# EAGLE design EBN_DUAL_V01 (EAGLE 7.3.0)
CNAME: EasyBoard Nano; CREVISION: 0.1; DESIGNER: Martin Olejar
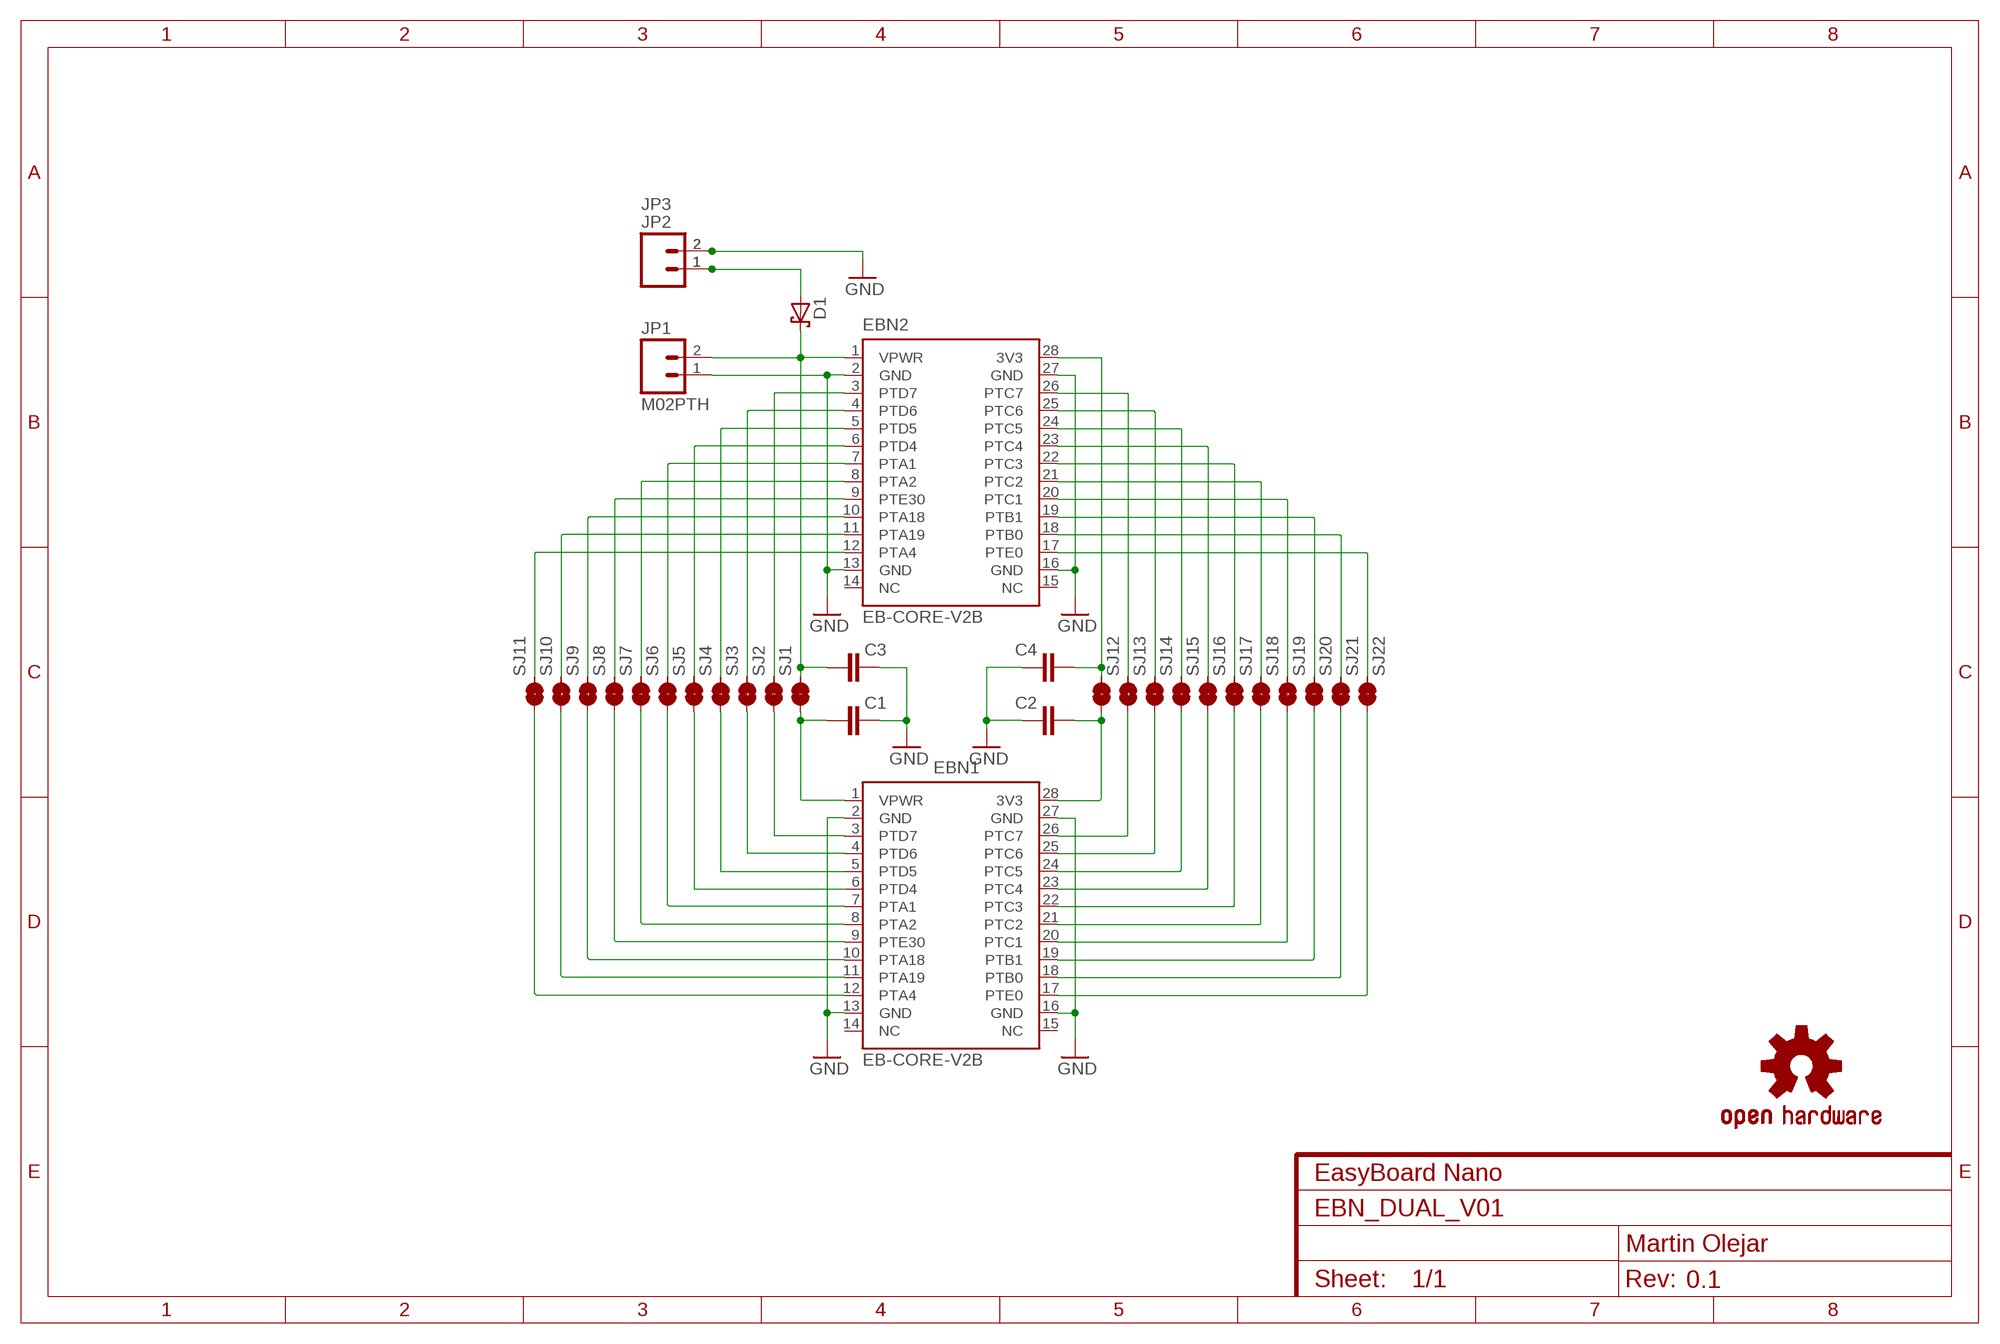
[diagram p0: schematic, sheet 1]

## Parts
C1  C-EUC0603  [C0603]
C2  C-EUC0603  [C0603]
C3  C-EUC0603  [C0603]
C4  C-EUC0603  [C0603]
D1  PMEG2010BER-SHOTTKY-SOD123FL  [SOD-123FL]
EBN1  EB-CORE-V2B  [DIL28-6B]
EBN2  EB-CORE-V2B  [DIL28-6B]
JP1  M02PTH  [1X02]
JP2  M02SMD  [1X02-1.25MM_SMD]
JP3  M02PTH3  [1X02_LONGPADS]
LOGO1  OSHW-LOGOS  [OSHW-LOGO-S]
SJ1  SJS  [JUMPER-SMD-S1XS]
SJ2  SJS  [JUMPER-SMD-S1XS]
SJ3  SJS  [JUMPER-SMD-S1XS]
SJ4  SJS  [JUMPER-SMD-S1XS]
SJ5  SJS  [JUMPER-SMD-S1XS]
SJ6  SJS  [JUMPER-SMD-S1XS]
SJ7  SJS  [JUMPER-SMD-S1XS]
SJ8  SJS  [JUMPER-SMD-S1XS]
SJ9  SJS  [JUMPER-SMD-S1XS]
SJ10  SJS  [JUMPER-SMD-S1XS]
SJ11  SJS  [JUMPER-SMD-S1XS]
SJ12  SJS  [JUMPER-SMD-S1XS]
SJ13  SJS  [JUMPER-SMD-S1XS]
SJ14  SJS  [JUMPER-SMD-S1XS]
SJ15  SJS  [JUMPER-SMD-S1XS]
SJ16  SJS  [JUMPER-SMD-S1XS]
SJ17  SJS  [JUMPER-SMD-S1XS]
SJ18  SJS  [JUMPER-SMD-S1XS]
SJ19  SJS  [JUMPER-SMD-S1XS]
SJ20  SJS  [JUMPER-SMD-S1XS]
SJ21  SJS  [JUMPER-SMD-S1XS]
SJ22  SJS  [JUMPER-SMD-S1XS]

## Nets
GND: C1.2 C2.1 C3.2 C4.1 EBN1.2(GND) EBN1.13(GND) EBN1.16(GND) EBN1.27(GND) EBN2.2(GND) EBN2.13(GND) EBN2.16(GND) EBN2.27(GND) JP1.1 JP2.2 JP3.2
N$1: C4.2 EBN2.28(3V3) SJ12.2
N$2: EBN1.26(PTC7) SJ13.1
N$3: EBN2.26(PTC7) SJ13.2
N$4: EBN2.25(PTC6) SJ14.2
N$5: EBN2.24(PTC5) SJ15.2
N$6: EBN2.23(PTC4) SJ16.2
N$7: EBN2.22(PTC3) SJ17.2
N$8: EBN2.21(PTC2) SJ18.2
N$9: EBN2.20(PTC1) SJ19.2
N$10: EBN2.19(PTB1) SJ20.2
N$11: EBN2.18(PTB0) SJ21.2
N$12: EBN2.17(PTE0) SJ22.2
N$13: EBN2.7(PTA1) SJ6.2
N$14: C3.1 D1.C EBN2.1(VPWR) JP1.2 SJ1.2
N$15: D1.A JP2.1 JP3.1
N$16: EBN2.3(PTD7) SJ2.2
N$17: EBN2.4(PTD6) SJ3.2
N$18: EBN2.5(PTD5) SJ4.2
N$19: EBN2.6(PTD4) SJ5.2
N$21: EBN2.8(PTA2) SJ7.2
N$22: EBN2.9(PTE30) SJ8.2
N$23: EBN2.10(PTA18) SJ9.2
N$24: EBN2.11(PTA19) SJ10.2
N$25: EBN2.12(PTA4) SJ11.2
N$27: C1.1 EBN1.1(VPWR) SJ1.1
N$29: EBN1.3(PTD7) SJ2.1
N$30: EBN1.4(PTD6) SJ3.1
N$31: EBN1.5(PTD5) SJ4.1
N$32: EBN1.6(PTD4) SJ5.1
N$33: EBN1.7(PTA1) SJ6.1
N$34: EBN1.8(PTA2) SJ7.1
N$35: EBN1.9(PTE30) SJ8.1
N$36: EBN1.10(PTA18) SJ9.1
N$37: EBN1.11(PTA19) SJ10.1
N$38: EBN1.12(PTA4) SJ11.1
N$40: C2.2 EBN1.28(3V3) SJ12.1
N$43: EBN1.25(PTC6) SJ14.1
N$44: EBN1.24(PTC5) SJ15.1
N$45: EBN1.23(PTC4) SJ16.1
N$46: EBN1.22(PTC3) SJ17.1
N$47: EBN1.21(PTC2) SJ18.1
N$48: EBN1.20(PTC1) SJ19.1
N$49: EBN1.19(PTB1) SJ20.1
N$50: EBN1.18(PTB0) SJ21.1
N$51: EBN1.17(PTE0) SJ22.1
Unconnected: EBN1.14(NC) EBN1.15(NC) EBN2.14(NC) EBN2.15(NC)

## Library data of the parts
C1-C4 = atomx_RLC:C-EU: CAPACITOR, European symbol
D1 = atomx_DiscreteSemi:*-SHOTTKY-
EBN1 EBN2 = atomx_EasyBoard:EB-CORE-V2
JP1-JP3 = atomx_Connectors:M02: Standard 2-pin 0.1" header. Use with - straight break away headers ( PRT-00116) - right angle break away headers (PRT-00553) - swiss pins (PRT-00743) - machine pins (PRT-00117) - female headers (PRT-00115) Molex polarized connector foot print use with: PRT-08233 with associated crimp pins and housings. 2.54_SCREWTERM for use with PRT-10571. 3.5mm Screw Terminal footprints for PRT-08084 5mm Screw Terminal footprints for use with PRT-08432
LOGO1 = atomx_Common:OSHW-LOGO: Open Source Hardware Logo This logo indicates the piece of hardware it is found on incorporates a OSHW license and/or adheres to the definition of open source hardware found here: http://freedomdefined.org/OSHW
SJ1-SJ22 = atomx_Connectors:SJS

## Board
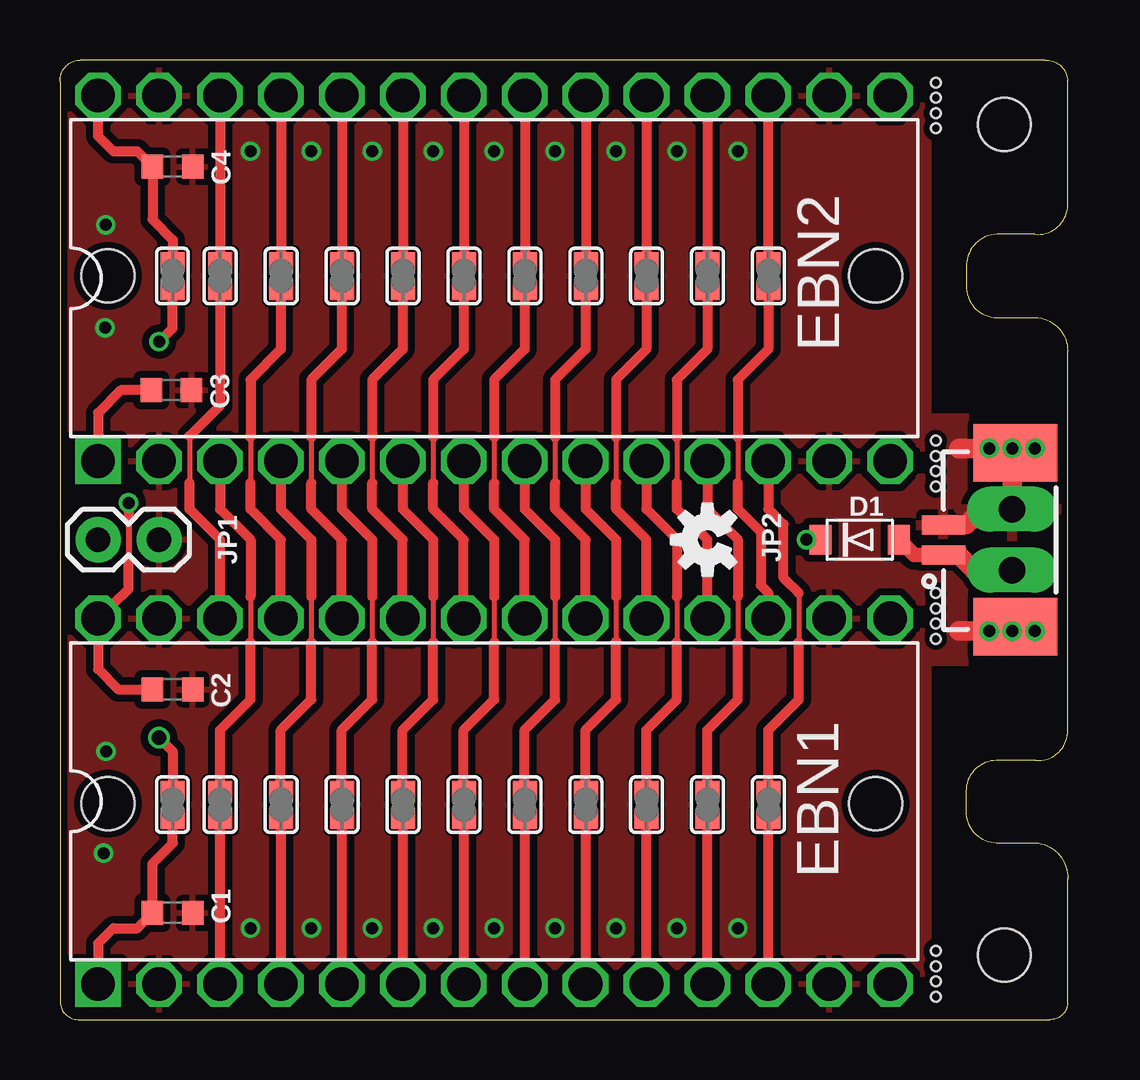
[diagram p1: board, top side]
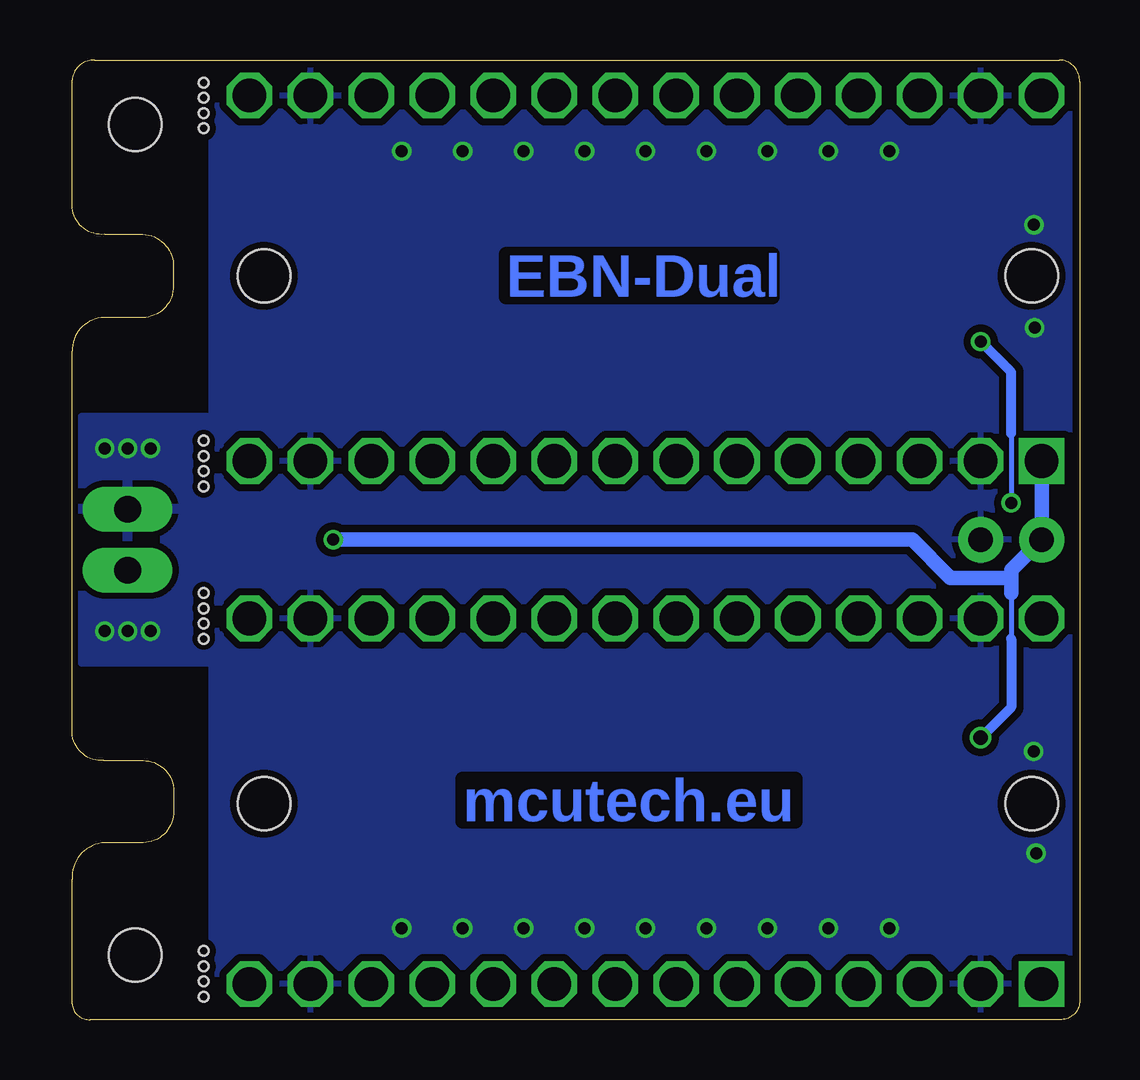
[diagram p2: board, bottom side, seen from below]

Size 42.01 x 40 mm. Coordinates in mm from the lower left corner, seen from the top.
Outline: 0.75,0 41.25,0 arc90 42,0.65 42,5.85 arc90 40.65,7.37 39.04,7.37 arc-90 37.77,8.69 37.77,9.53 arc-90 39.04,10.8 40.68,10.8 arc90 42.01,11.96 42,18.12 42,27.87 arc90 40.66,29.26 39.05,29.26 arc-90 37.78,30.58 37.78,31.37 arc-90 39.05,32.74 40.65,32.74 arc90 42,33.84 42,39.15 arc90 41.05,40 0.85,40 arc90 0,39.1 0,0.8 arc90 0.75,0
Copper layers (1*16): Top 0.035mm / dielectric 1.5mm / Bottom 0.035mm
Design rules "ITEADstudio_DRC *": minimum track width 6mil, minimum drill 10mil, track to track 10mil, track to pad 10mil, pad to pad 10mil, via to via 10mil, smd to smd 0mil, copper to edge 10mil, drill to drill 10mil, minimum pad ring 8mil, minimum via ring 6mil, stop-mask expansion 2mil, vias tented up to drill 100mil, thermal gap 10mil
Holes 0.4 mm at 36.51,39.05 36.51,38.42 36.51,37.78 36.51,37.15 36.51,24.13 36.51,23.5 36.51,22.86 36.51,22.23 36.51,17.78 36.51,17.15 36.51,16.51 36.51,15.88 36.51,2.86 36.51,2.22 36.51,1.59 36.51,0.95
Holes 2.2 mm at 39.37,37.32 39.37,2.69 2,31 2,9 34,9 34,31

### Footprints (pad centres in the part's own frame; a part is rotated, then mirrored left to right if it is on the bottom)
C0603 = smd 0.9 x 1: 1 -0.84,0; 2 0.84,0
SOD-123FL = smd 0.91 x 1.22: A 1.637,0; C -1.637,0
DIL28-6B = drill 1.4 pad 1.9 square: 1 -16.51,-7.62 | drill 1.4 pad 1.9 octagon: 2 -13.97,-7.62; 3 -11.43,-7.62; 4 -8.89,-7.62; 5 -6.35,-7.62; 6 -3.81,-7.62; 7 -1.27,-7.62; 8 1.27,-7.62; 9 3.81,-7.62; 10 6.35,-7.62; 11 8.89,-7.62; 12 11.43,-7.62; 13 13.97,-7.62; 14 16.51,-7.62; 15 16.51,7.62; 16 13.97,7.62; 17 11.43,7.62; 18 8.89,7.62; 19 6.35,7.62; 20 3.81,7.62; 21 1.27,7.62; 22 -1.27,7.62; 23 -3.81,7.62; 24 -6.35,7.62; 25 -8.89,7.62; 26 -11.43,7.62; 27 -13.97,7.62; 28 -16.51,7.62
1X02 = drill 1.016 pad 1.88: 1 0,0; 2 2.54,0
1X02-1.25MM_SMD = smd 0.8 x 1.8: 1 0,0; 2 1.25,0 | smd 2.4 x 3.5: P$5 -3,-3; P$6 4.25,-3
1X02_LONGPADS = drill 1.118 pad 1.88 long: 1 0,0; 2 2.54,0
JUMPER-SMD-S1XS = smd 0.8 x 1: 1 -0.6,-0.01; 2 0.6,-0.01

### Placement (x,y rotation side)
C1  4.7,4.45 0 top
C2  4.7,13.77 180 top
C3  4.64,26.24 0 top
C4  4.7,35.56 180 top
D1  33.34,20 0 top
EBN1  18.1,9.1 0 top
EBN2  18.1,30.9 0 top
JP1  4.13,20 180 top
JP2  36.83,19.37 90 top
JP3  39.69,18.73 90 top
LOGO1  26.99,20 90 top
SJ1  4.68,8.96 90 top
SJ2  6.67,8.96 90 top
SJ3  9.21,8.96 90 top
SJ4  11.75,8.96 90 top
SJ5  14.29,8.96 90 top
SJ6  16.83,8.96 90 top
SJ7  19.37,8.96 90 top
SJ8  21.91,8.96 90 top
SJ9  24.45,8.96 90 top
SJ10  26.99,8.96 90 top
SJ11  29.53,8.96 90 top
SJ12  4.68,31 90 top
SJ13  6.67,31 90 top
SJ14  9.21,31 90 top
SJ15  11.75,31 90 top
SJ16  14.29,31 90 top
SJ17  16.83,31 90 top
SJ18  19.37,31 90 top
SJ19  21.91,31 90 top
SJ20  24.45,31 90 top
SJ21  26.99,31 90 top
SJ22  29.53,31 90 top

### Tracks (layer width: path | path; a pad name or v marks a point on that pad's centre or on a via)
GND  (via drill 0.5)
  Top 0.813: v38.73,23.81 37.47,23.81 | v38.73,16.19 37.47,16.19 | v39.69,23.81 JP3.2 38.42,21.27 37.78,20.64 36.83,20.64
  other vias: 7.94,3.81 10.48,3.81 13.02,3.81 15.56,3.81 18.1,3.81 20.64,3.81 23.18,3.81 25.72,3.81 28.26,3.81 1.91,33.13 1.88,28.84 7.94,36.2 10.48,36.2 13.02,36.2 15.56,36.2 18.1,36.2 20.64,36.2 23.18,36.2 25.72,36.2 28.26,36.2 40.64,23.81 39.69,16.19 40.64,16.19 1.92,11.18 1.82,6.94
  pour Top (isolate 0.305): 0,40.01 36.2,40.01 36.2,0 0,0
  pour Bottom (isolate 0.305): 0,40.01 36.2,40.01 36.2,0 0,0
  pour Top: 35.88,25.08 41.59,25.08 41.59,14.92 35.88,14.92
  pour Bottom: 35.88,25.08 41.59,25.08 41.59,14.92 35.88,14.92
N$1
  Top 0.406: EBN2.28 1.59,36.83 2.22,36.2 3.22,36.2 C4.2 3.85,33.35 4.7,32.5 SJ12.2
N$2
  Top 0.2: 5.4,24.33 5.4,22.38
  Top 0.406: SJ13.1 6.67,30.19 6.67,25.6 5.4,24.33 | EBN1.26 6.67,20 5.4,21.27 5.4,22.38
N$3
  Top 0.406: EBN2.26 6.68,38.41 SJ13.2
N$4
  Top 0.406: EBN2.25 9.22,38.41 SJ14.2
N$5
  Top 0.406: EBN2.24 11.76,38.41 SJ15.2
N$6
  Top 0.406: EBN2.23 14.3,38.41 SJ16.2
N$7
  Top 0.406: EBN2.22 16.84,38.41 SJ17.2
N$8
  Top 0.406: EBN2.21 19.38,38.41 SJ18.2
N$9
  Top 0.406: EBN2.20 21.92,38.41 SJ19.2
N$10
  Top 0.406: EBN2.19 24.46,38.41 SJ20.2
N$11
  Top 0.406: EBN2.18 27,38.41 SJ21.2
N$12
  Top 0.406: SJ22.2 29.53,31.41 EBN2.17
N$13
  Top 0.2: 18.1,17.63 18.1,15.73
  Top 0.406: SJ6.2 16.83,9.82 16.83,12.07 18.1,13.34 18.1,15.73 | EBN2.7 16.83,21.27 18.1,20 18.1,17.63
N$14  (via drill 0.5, 0.6)
  Top 0.406: EBN2.1 1.59,25.29 2.54,26.24 C3.1 | D1.C v31.11,20 | v4.13,11.75 4.69,11.19 SJ1.2
  Bottom 0.2: 2.86,17.78 2.86,15.88
  Bottom 0.406: 2.86,15.88 2.86,13.02 v4.13,11.75
  Bottom 0.61: EBN2.1 JP1.2 2.86,18.73 2.86,18.42 | 2.86,18.42 2.86,17.78 | v31.11,20 6.99,20 5.4,18.42 2.86,18.42
N$15
  Top 0.61: JP2.1 35.61,19.37 D1.A
  Top 0.813: JP2.1 37.47,19.37 38.1,18.73 JP3.1
N$16
  Top 0.2: 7.94,17.63 7.94,15.73
  Top 0.406: EBN2.3 6.67,21.27 7.94,20 7.94,17.63 | SJ2.2 6.67,9.82 6.67,12.07 7.94,13.34 7.94,15.73
N$17
  Top 0.2: 10.48,17.63 10.48,15.73
  Top 0.406: EBN2.4 9.21,21.27 10.48,20 10.48,17.63 | SJ3.2 9.21,9.82 9.21,12.07 10.48,13.34 10.48,15.73
N$18
  Top 0.2: 13.02,17.63 13.02,15.73
  Top 0.406: EBN2.5 11.75,21.27 13.02,20 13.02,17.63 | SJ4.2 11.75,9.82 11.75,12.07 13.02,13.34 13.02,15.73
N$19
  Top 0.2: 15.56,17.63 15.56,15.73
  Top 0.406: EBN2.6 14.29,21.27 15.56,20 15.56,17.63 | SJ5.2 14.29,9.82 14.29,12.07 15.56,13.34 15.56,15.73
N$21
  Top 0.2: 20.64,17.63 20.64,15.73
  Top 0.406: SJ7.2 19.37,9.82 19.37,12.07 20.64,13.34 20.64,15.73 | EBN2.8 19.37,21.27 20.64,20 20.64,17.63
N$22
  Top 0.2: 23.18,17.63 23.18,15.78
  Top 0.406: SJ8.2 21.91,9.82 21.91,12.07 23.18,13.34 23.18,15.78 | EBN2.9 21.91,21.27 23.18,20 23.18,17.63
N$23
  Top 0.2: 25.72,17.63 25.72,15.73
  Top 0.406: SJ9.2 24.45,9.82 24.45,12.07 25.72,13.34 25.72,15.73 | EBN2.10 24.45,21.27 25.72,20 25.72,17.63
N$24
  Top 0.2: 28.26,17.63 28.26,15.73
  Top 0.406: SJ10.2 26.99,9.82 26.99,12.07 28.26,13.34 28.26,15.73 | EBN2.11 26.99,21.27 28.26,20 28.26,17.63
N$25
  Top 0.2: 30.8,17.78 30.8,15.73
  Top 0.406: SJ11.2 29.53,9.82 29.53,12.07 30.8,13.34 30.8,15.73 | EBN2.12 29.53,21.27 30.16,20.64 30.16,18.42 30.8,17.78
N$27
  Top 0.406: EBN1.1 1.59,3.18 2.22,3.81 3.22,3.81 C1.1 3.85,6.51 4.7,7.35 4.7,8.35 SJ1.1
N$29
  Top 0.406: EBN1.3 6.68,1.6 SJ2.1
N$30
  Top 0.406: EBN1.4 9.22,1.6 SJ3.1
N$31
  Top 0.406: EBN1.5 11.76,1.6 SJ4.1
N$32
  Top 0.406: EBN1.6 14.3,1.6 SJ5.1
N$33
  Top 0.406: EBN1.7 16.84,1.6 SJ6.1
N$34
  Top 0.406: EBN1.8 19.38,1.6 SJ7.1
N$35
  Top 0.406: EBN1.9 21.92,1.6 SJ8.1
N$36
  Top 0.406: EBN1.10 24.46,1.6 SJ9.1
N$37
  Top 0.406: EBN1.11 27,1.6 SJ10.1
N$38
  Top 0.406: EBN1.12 29.54,1.6 SJ11.1
N$40  (via drill 0.5)
  Top 0.254: 2.86,20.96 2.86,19.05
  Top 0.406: 2.86,19.05 2.86,17.95 EBN1.28 1.59,14.61 2.42,13.77 C2.2 | v2.86,21.54 2.86,20.96 | v4.13,28.26 4.69,28.82 SJ12.1
  Bottom 0.2: 2.86,24.45 v2.86,21.54
  Bottom 0.406: 2.86,24.45 2.86,26.99 v4.13,28.26
N$43
  Top 0.2: 7.94,24.28 7.94,22.38
  Top 0.406: SJ14.1 9.21,30.19 9.21,27.94 7.94,26.67 7.94,24.28 | EBN1.25 9.21,20 7.94,21.27 7.94,22.38
N$44
  Top 0.2: 10.48,24.28 10.48,22.38
  Top 0.406: SJ15.1 11.75,30.19 11.75,27.94 10.48,26.67 10.48,24.28 | EBN1.24 11.75,20 10.48,21.27 10.48,22.38
N$45
  Top 0.2: 13.02,24.28 13.02,22.38
  Top 0.406: SJ16.1 14.29,30.19 14.29,27.94 13.02,26.67 13.02,24.28 | EBN1.23 14.29,20 13.02,21.27 13.02,22.38
N$46
  Top 0.2: 15.56,24.28 15.56,22.38
  Top 0.406: SJ17.1 16.83,30.19 16.83,27.94 15.56,26.67 15.56,24.28 | EBN1.22 16.83,20 15.56,21.27 15.56,22.38
N$47
  Top 0.2: 18.1,24.28 18.1,22.38
  Top 0.406: SJ18.1 19.37,30.19 19.37,27.94 18.1,26.67 18.1,24.28 | EBN1.21 19.37,20 18.1,21.27 18.1,22.38
N$48
  Top 0.2: 20.64,24.28 20.64,22.38
  Top 0.406: SJ19.1 21.91,30.19 21.91,27.94 20.64,26.67 20.64,24.28 | EBN1.20 21.91,20 20.64,21.27 20.64,22.38
N$49
  Top 0.2: 23.18,24.28 23.18,22.38
  Top 0.406: SJ20.1 24.45,30.19 24.45,27.94 23.18,26.67 23.18,24.28 | EBN1.19 24.45,20 23.18,21.27 23.18,22.38
N$50
  Top 0.2: 25.72,24.28 25.72,22.38
  Top 0.406: SJ21.1 26.99,30.19 26.99,27.94 25.72,26.67 25.72,24.28 | EBN1.18 26.99,20 25.72,21.27 25.72,22.38
N$51
  Top 0.2: 28.26,24.28 28.26,22.38
  Top 0.406: SJ22.1 29.53,30.19 29.53,27.94 28.26,26.67 28.26,24.28 | 28.26,22.38 28.26,21.27 29.21,20.32 29.21,18.1 29.53,17.78 EBN1.17

### Text on the board
Bottom: EBN-Dual | mcutech.eu